# Altium project DCDC.PrjPcb
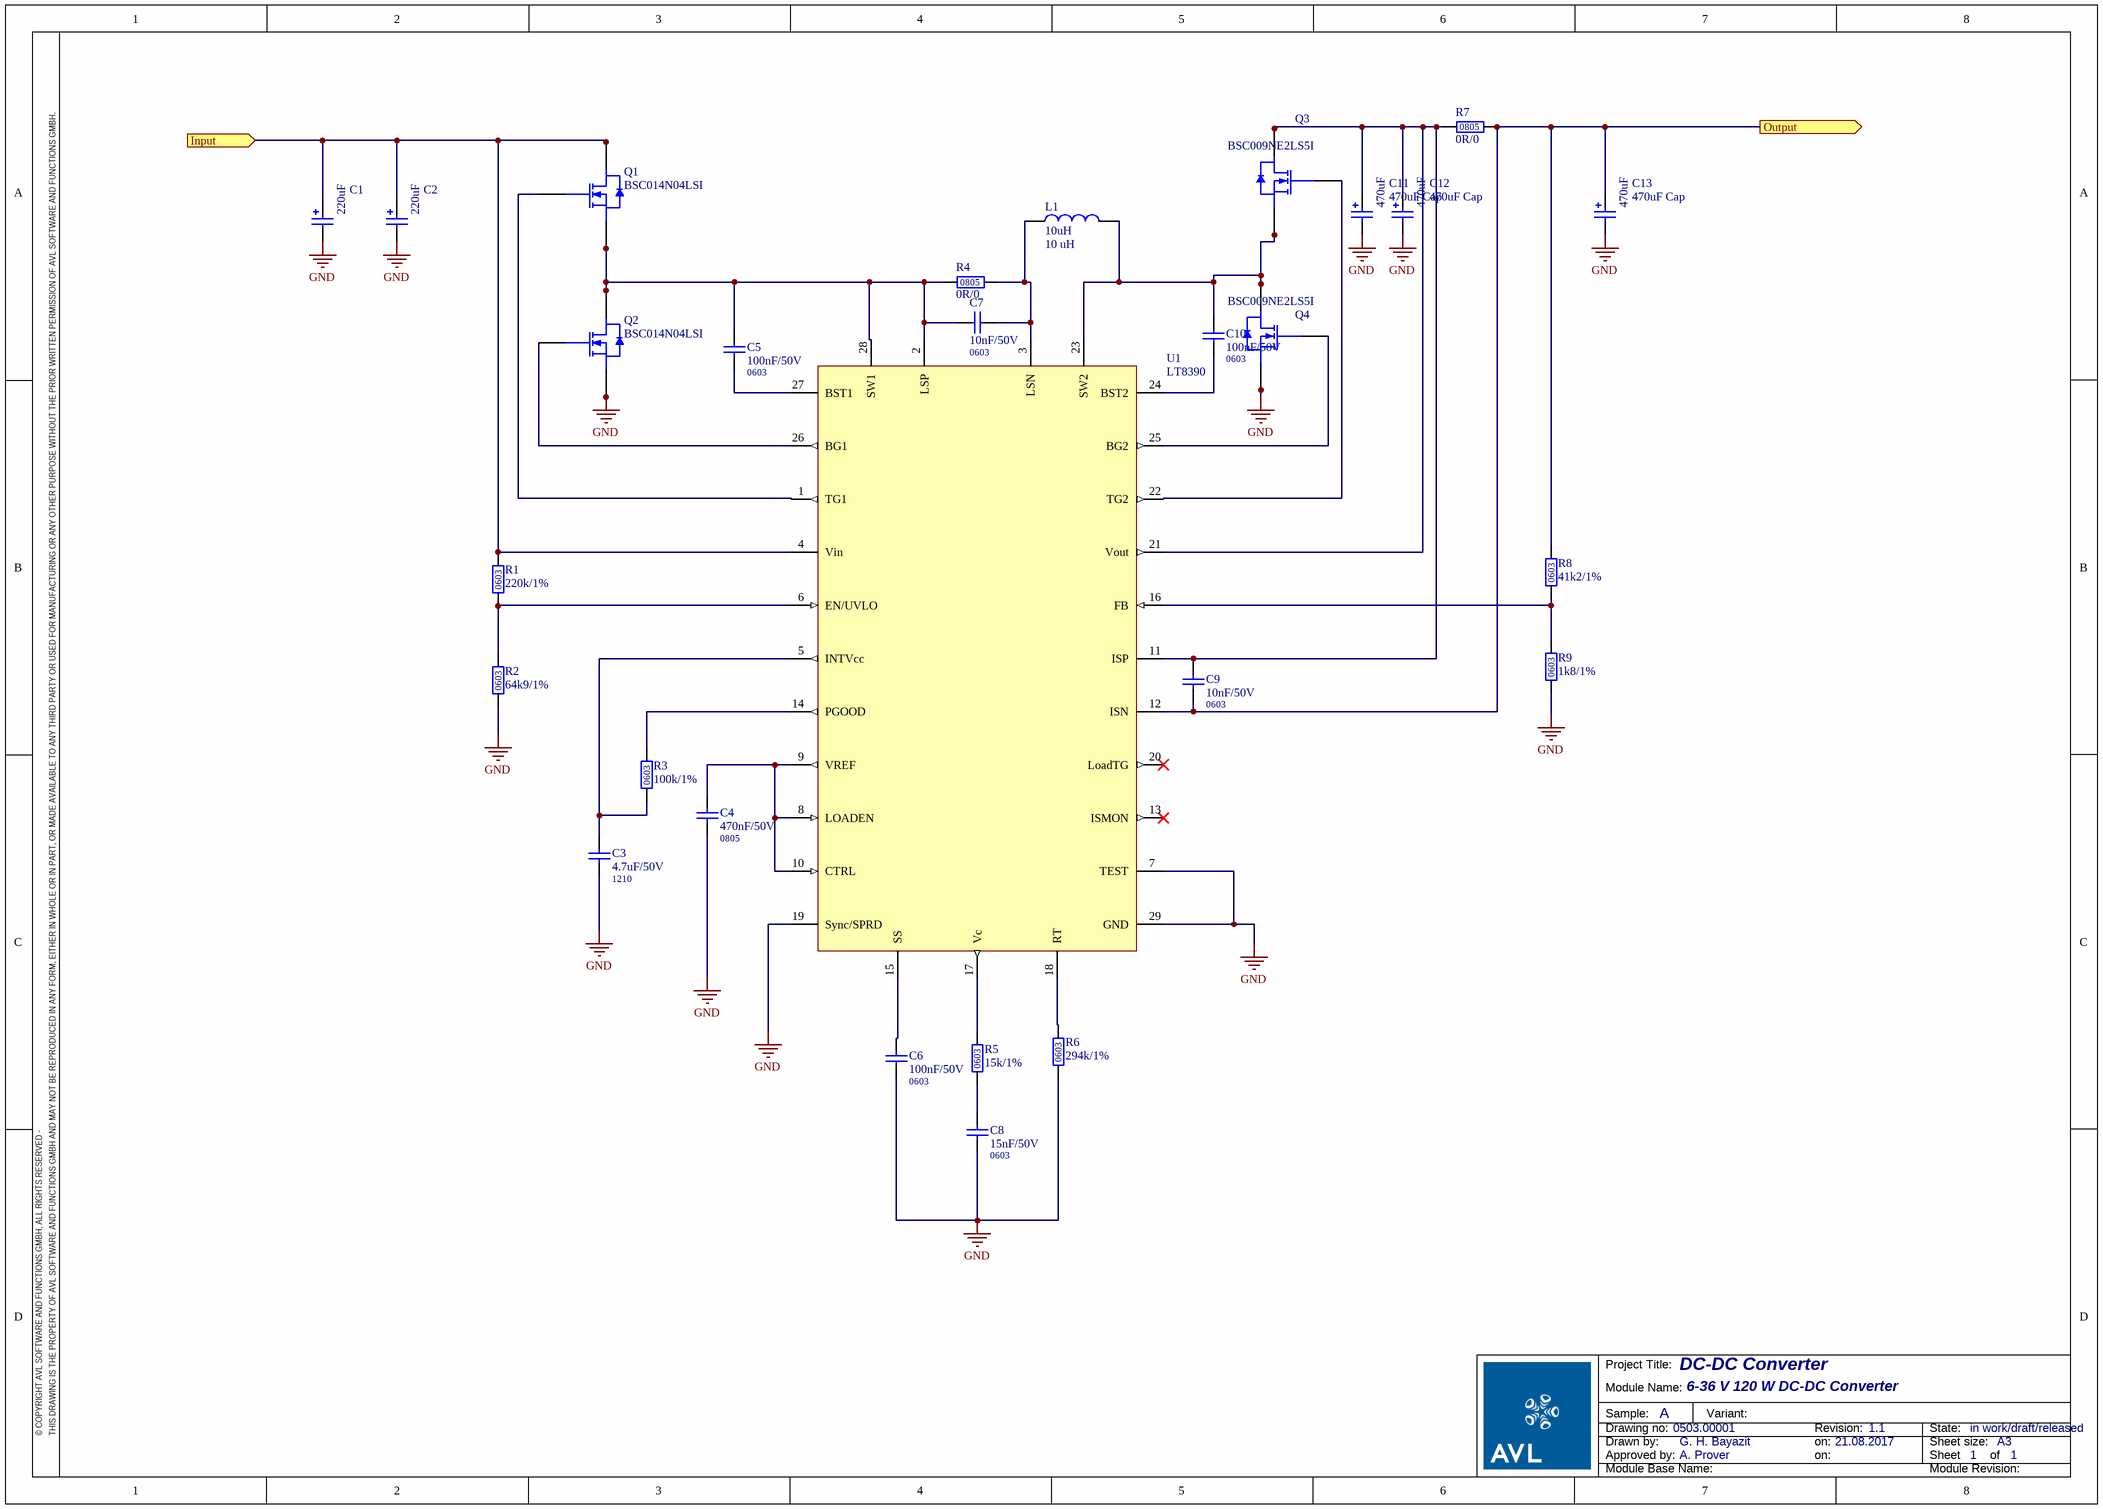
[diagram p0: DCDC_Buck_Boost.SchDoc]
Customer: Customer; DesignRevision: 1.1; PCBApprovalDate: 02.12.2014; PCBApprovedBy: P. Approver; PCBAssembledNo: 0500.00001; PCBDrawnBy: P. CB; PCBDrawnDate: 30.11.2014; PCBRevision: 1.1; PCBState: in work/draft/released; PCBUnassembledNo: 0507.00001; ProjectSample: A; ProjectTitle: DC-DC Converter; SchematicApprovedBy: A. Prover; SchematicDrawnBy: G. H. Bayazit; SchematicDrawnDate: 21.08.2017; SchematicDrawNo: 0503.00001; SchematicRevision: 1.1; SchematicState: in work/draft/released
1 sheet, 28 parts. Net scope: strictly hierarchical (ports join the sheet entries above them; power ports are local).
Board file: DCDC_Buck_Boost.PcbDoc

## Sheet DCDC_Buck_Boost.SchDoc: 6-36 V 120 W DC-DC Converter
size A3; SheetNumber: 1; SheetTotal: 1

### Parts
C1  220uF Cap  [WCAP-ASLI_4x5.5]  (value not drawn)
C2  220uF Cap  [WCAP-ASLI_4x5.5]  (value not drawn)
C3  4.7uF/50V  Package: 1210  [CAPC3225X30]
C4  470nF/50V  Package: 0805  [CAPC2012X15]
C5  100nF/50V  Package: 0603  [CAPC1608X10]
C6  100nF/50V  Package: 0603  [CAPC1608X10]
C7  10nF/50V  Package: 0603  [CAPC1608X10]
C8  15nF/50V  Package: 0603  [CAPC1608X10]
C9  10nF/50V  Package: 0603  [CAPC1608X10]
C10  100nF/50V  Package: 0603  [CAPC1608X10]
C11  470uF Cap  [WCAP-ASLL_4x5.5]
C12  470uF Cap  [WCAP-ASLL_4x5.5]
C13  470uF Cap  [WCAP-ASLL_4x5.5]
L1  10uH  value 10 uH  [WE-HCF_2818]
Q1  BSC014N04LSI  [TDSON-8-FL]
Q2  BSC014N04LSI  [TDSON-8-FL]
Q3  BSC009NE2LS5I  [TDSON-8-FL]
Q4  BSC009NE2LS5I  [TDSON-8-FL]
R1  220k/1%  Package: 0603  [RESC1608X05]
R2  64k9/1%  Package: 0603  [RESC1608X05]
R3  100k/1%  Package: 0603  [RESC1608X05]
R4  0R/0  Package: 0805  [RESC2012X05]
R5  15k/1%  Package: 0603  [RESC1608X05]
R6  294k/1%  Package: 0603  [RESC1608X05]
R7  0R/0  Package: 0805  [RESC2012X05]
R8  41k2/1%  Package: 0603  [RESC1608X05]
R9  1k8/1%  Package: 0603  [RESC1608X05]
U1  LT8390  [LT3890]

### Ports
Input, Output (out)

### Nets
GND: C1.2(N) C2.2(N) C3.1 C4.1 C6.2 C8.2 C11.2(N) C12.2(N) C13.2(N) Q2.1(S) Q2.2(S) Q2.3(S) Q4.1(S) Q4.2(S) Q4.3(S) R2.2 R6.2 R9.1 U1.7(TEST) U1.19(Sync/SPRD) U1.29(GND)
Input: C1.1(P) C2.1(P) Q1.5(D) Q1.6(D) Q1.7(D) Q1.8(D) R1.1 U1.4(Vin) ; port Input
Output: C9.2 C13.1(P) R7.2 R8.2 U1.12(ISN) ; port Output
NetC3_2: C3.2 R3.1 U1.5(INTVcc)
NetC4_2: C4.2 U1.8(LOADEN) U1.9(VREF) U1.10(CTRL)
NetC5_1: C5.1 C7.2 Q1.1(S) Q1.2(S) Q1.3(S) Q2.5(D) Q2.6(D) Q2.7(D) Q2.8(D) R4.1 U1.2(LSP) U1.28(SW1)
NetC5_2: C5.2 U1.27(BST1)
NetC6_1: C6.1 U1.15(SS)
NetC7_1: C7.1 L1.1 R4.2 U1.3(LSN)
NetC8_1: C8.1 R5.2
NetC9_1: C9.1 C11.1(P) C12.1(P) Q3.5(D) Q3.6(D) Q3.7(D) Q3.8(D) R7.1 U1.11(ISP) U1.21(Vout)
NetC10_1: C10.1 L1.2 Q3.1(S) Q3.2(S) Q3.3(S) Q4.5(D) Q4.6(D) Q4.7(D) Q4.8(D) U1.23(SW2)
NetC10_2: C10.2 U1.24(BST2)
NetQ1_4: Q1.4(G) U1.1(TG1)
NetQ2_4: Q2.4(G) U1.26(BG1)
NetQ3_4: Q3.4(G) U1.22(TG2)
NetQ4_4: Q4.4(G) U1.25(BG2)
NetR1_2: R1.2 R2.1 U1.6(EN/UVLO)
NetR3_2: R3.2 U1.14(PGOOD)
NetR5_1: R5.1 U1.17(Vc)
NetR6_1: R6.1 U1.18(RT)
NetR8_1: R8.1 R9.2 U1.16(FB)

Not connected (* = marked no-connect by the designer): U1 13(ISMON)* 20(LoadTG)*

### Notes on the sheet
- Module Name:
- Project Title:
- © COPYRIGHT AVL SOFTWARE AND FUNCTIONS GMBH, ALL RIGHTS RESERVED -
- THIS DRAWING IS THE PROPERTY OF AVL SOFTWARE AND FUNCTIONS GMBH AND MAY NOT BE REPRODUCED IN ANY FORM, EITHER IN WHOLE OR IN PART, OR MADE AVAILABLE TO ANY THIRD PARTY OR USED FOR MANUFACTURING OR ANY OTHER PURPOSE WITHOUT THE PRIOR WRITTEN PERMISSION OF AVL SOFTWARE AND FUNCTIONS GMBH.
- Drawn by:
- Approved by:
- Sample:
- Drawing no:
- Variant:
- on:
- Revision:
- State:
- Sheet
- Sheet size:
- of
- A3
- Module Base Name:
- Module Revision:
- (in symbol 220uF Cap) 220uF
- (in symbol 470uF Cap) 470uF

### Library data of the parts
C1 C2 = 220uF Cap: ESR: 0.23 Ohm; Capacitance: 220 uF
C3 = 0444.00103: Part_Value: 4.7uF; Manufacturer: Murata; Voltage: 50V; Type: X7R; Ordering Code: GCM32ER71H475KA55L; Tolerance: 10%; Part_Number: 0444.00103; Temperature min: -55°C; Temperature max: 125°C; Automotive: YES; Mount: SMD; ComponentLink1Description: Murata_GCM_Datasheet_03.2014.pdf; ComponentLink1URL: D:\__Altium\03_AVL_EHW_Comp_Lib\Datasheet\0444_Capacitor_Ceramic\Murata_GCM_Datasheet_03.2014.pdf
C4 = 0444.00090: Part_Value: 470nF; Part_Number_old: CC0095; Manufacturer: Murata; Voltage: 50V; Type: X7R; Ordering Code: GCM21BR71H474KA55L; Component State: Development released; Tolerance: 10%; Part_Number: 0444.00090; Temperature min: -55°C; Temperature max: 125°C; Automotive: YES; Mount: SMD; ComponentLink1Description: Murata_GCM_Datasheet_03.2014.pdf; ComponentLink1URL: D:\__Altium\03_AVL_EHW_Comp_Lib\Datasheet\0444_Capacitor_Ceramic\Murata_GCM_Datasheet_03.2014.pdf
C5 C6 C10 = 0444.00073: Part_Value: 100nF; Part_Number_old: CC0071; Manufacturer: Murata; Voltage: 50V; Type: X7R; Ordering Code: GCM188R71H104KA57D; Component State: Development released; Tolerance: 10%; Part_Number: 0444.00073; Temperature min: -55°C; Temperature max: 125°C; Automotive: YES; Mount: SMD; ComponentLink1Description: Murata_GCM_Datasheet_03.2014.pdf; ComponentLink1URL: D:\__Altium\03_AVL_EHW_Comp_Lib\Datasheet\0444_Capacitor_Ceramic\Murata_GCM_Datasheet_03.2014.pdf
C7 C9 = 0444.00053: Part_Value: 10nF; Part_Number_old: CC0101; Manufacturer: Murata; Voltage: 50V; Type: X7R; Ordering Code: GCM188R71H103KA37D; Component State: Development released; Tolerance: 10%; Part_Number: 0444.00053; Temperature min: -55°C; Temperature max: 125°C; Automotive: YES; Mount: SMD; ComponentLink1Description: Murata_GCM_Datasheet_03.2014.pdf; ComponentLink1URL: D:\__Altium\03_AVL_EHW_Comp_Lib\Datasheet\0444_Capacitor_Ceramic\Murata_GCM_Datasheet_03.2014.pdf
C8 = 0444.00059: Part_Value: 15nF; Manufacturer: Murata; Voltage: 50V; Type: X7R; Ordering Code: GCM188R71H153KA37D; Tolerance: 10%; Part_Number: 0444.00059; Temperature min: -55°C; Temperature max: 125°C; Automotive: YES; Mount: SMD; ComponentLink1Description: Murata_GCM_Datasheet_03.2014.pdf; ComponentLink1URL: D:\__Altium\03_AVL_EHW_Comp_Lib\Datasheet\0444_Capacitor_Ceramic\Murata_GCM_Datasheet_03.2014.pdf
C11-C13 = 470uF Cap: ESR: 66 mOhm; Capacitance: 470 uF
L1 = 10uH: WE-HCF SMD High Current Inductor, size 2818, 10 uH; Part Number: 7443641000; Rated Current: 30 A; ComponentLink1Description: Manufacturer; ComponentLink1URL: http://www.we-online.de; ComponentLink2Description: Datasheet; ComponentLink2URL: http://katalog.we-online.de/pbs/datasheet/7443641000.pdf; Published Date: May 2017; Publisher: Wurth Elektronik; Size: 2818
R1 = 0440.00197: Part_Value: 220k; Part_Number_old: RE0222; Manufacturer: Vishay; TOLERANCE: 1%; Ordering Code: CRCW0603220KFKEA; Component State: Development released; Power: 0.1W; Voltage: 75V; Temperature coefficient: TK100; Part_Number: 0440.00197; Temperature min: -55°C; Temperature max: 155°C; Type: THICK FILM; Automotive: YES; Mount: SMD; ComponentLink1Description: Vishay_DCRCWE3_Datasheet_04.06.12.pdf; ComponentLink1URL: D:\__Altium\03_AVL_EHW_Comp_Lib\Datasheet\0440_Resistor_fixed\Vishay_DCRCWE3_Datasheet_04.06.12.pdf
R2 = 0440.00282: Part_Value: 64k9; Manufacturer: Vishay; TOLERANCE: 1%; Ordering Code: CRCW060364K9FKEA; Power: 0.1W; Voltage: 75V; Temperature coefficient: TK100; Part_Number: 0440.00282; Temperature min: -55°C; Temperature max: 155°C; Type: THICK FILM; Automotive: YES; Mount: SMD; ComponentLink1Description: Vishay_DCRCWE3_Datasheet_04.06.12.pdf; ComponentLink1URL: D:\__Altium\03_AVL_EHW_Comp_Lib\Datasheet\0440_Resistor_fixed\Vishay_DCRCWE3_Datasheet_04.06.12.pdf
R3 = 0440.00176: Part_Value: 100k; Part_Number_old: RE0269; Manufacturer: Vishay; TOLERANCE: 1%; Ordering Code: CRCW0603100KFKEA; Component State: Development released; Power: 0.1W; Voltage: 75V; Temperature coefficient: TK100; Part_Number: 0440.00176; Temperature min: -55°C; Temperature max: 155°C; Type: THICK FILM; Automotive: YES; Mount: SMD; ComponentLink1Description: Vishay_DCRCWE3_Datasheet_04.06.12.pdf; ComponentLink1URL: D:\__Altium\03_AVL_EHW_Comp_Lib\Datasheet\0440_Resistor_fixed\Vishay_DCRCWE3_Datasheet_04.06.12.pdf
R4 R7 = 0440.00003: Part_Value: 0R; Part_Number_old: RE0090; Manufacturer: Vishay; TOLERANCE: 0; Ordering Code: CRCW08050000Z0EA; Component State: Development released; Power: 0.125W; Voltage: 150V; Temperature coefficient: TK100; Part_Number: 0440.00003; Temperature min: -55°C; Temperature max: 155°C; Type: THICK FILM; Automotive: YES; Mount: SMD; ComponentLink1Description: Vishay_DCRCWE3_Datasheet_04.06.12.pdf; ComponentLink1URL: D:\__Altium\03_AVL_EHW_Comp_Lib\Datasheet\0440_Resistor_fixed\Vishay_DCRCWE3_Datasheet_04.06.12.pdf
R5 = 0440.00148: Part_Value: 15k; Part_Number_old: RE0199; Manufacturer: Vishay; TOLERANCE: 1%; Ordering Code: CRCW060315K0FKEA; Component State: Development released; Power: 0.1W; Voltage: 75V; Temperature coefficient: TK100; Part_Number: 0440.00148; Temperature min: -55°C; Temperature max: 155°C; Type: THICK FILM; Automotive: YES; Mount: SMD; ComponentLink1Description: Vishay_DCRCWE3_Datasheet_04.06.12.pdf; ComponentLink1URL: D:\__Altium\03_AVL_EHW_Comp_Lib\Datasheet\0440_Resistor_fixed\Vishay_DCRCWE3_Datasheet_04.06.12.pdf
R6 = 0440.00329: Part_Value: 294k; Manufacturer: Vishay; TOLERANCE: 1%; Ordering Code: CRCW0603294KFKEA; Power: 0.1W; Voltage: 75V; Temperature coefficient: TK100; Part_Number: 0440.00329; Temperature min: -55°C; Temperature max: 155°C; Type: THICK FILM; Automotive: YES; Mount: SMD; ComponentLink1Description: Vishay_DCRCWE3_Datasheet_04.06.12.pdf; ComponentLink1URL: D:\__Altium\03_AVL_EHW_Comp_Lib\Datasheet\0440_Resistor_fixed\Vishay_DCRCWE3_Datasheet_04.06.12.pdf
R8 = 0440.00284: Part_Value: 41k2; Manufacturer: Vishay; TOLERANCE: 1%; Ordering Code: CRCW060341K2FKEA; Power: 0.1W; Voltage: 75V; Temperature coefficient: TK100; Part_Number: 0440.00284; Temperature min: -55°C; Temperature max: 155°C; Type: THICK FILM; Automotive: YES; Mount: SMD; ComponentLink1Description: Vishay_DCRCWE3_Datasheet_04.06.12.pdf; ComponentLink1URL: D:\__Altium\03_AVL_EHW_Comp_Lib\Datasheet\0440_Resistor_fixed\Vishay_DCRCWE3_Datasheet_04.06.12.pdf
R9 = 0440.00105: Part_Value: 1k8; Manufacturer: Vishay; TOLERANCE: 1%; Ordering Code: CRCW06031K80FKEA; Power: 0.1W; Voltage: 75V; Temperature coefficient: TK100; Part_Number: 0440.00105; Temperature min: -55°C; Temperature max: 155°C; Type: THICK FILM; Automotive: YES; Mount: SMD; ComponentLink1Description: Vishay_DCRCWE3_Datasheet_04.06.12.pdf; ComponentLink1URL: D:\__Altium\03_AVL_EHW_Comp_Lib\Datasheet\0440_Resistor_fixed\Vishay_DCRCWE3_Datasheet_04.06.12.pdf
U1 = LT8390: pin to pad: 29>M1

## Assembly variants
MASTER: all parts fitted